# EAGLE design Board_Master_PROTO_V2_Mob_Project (EAGLE 9.5.0)
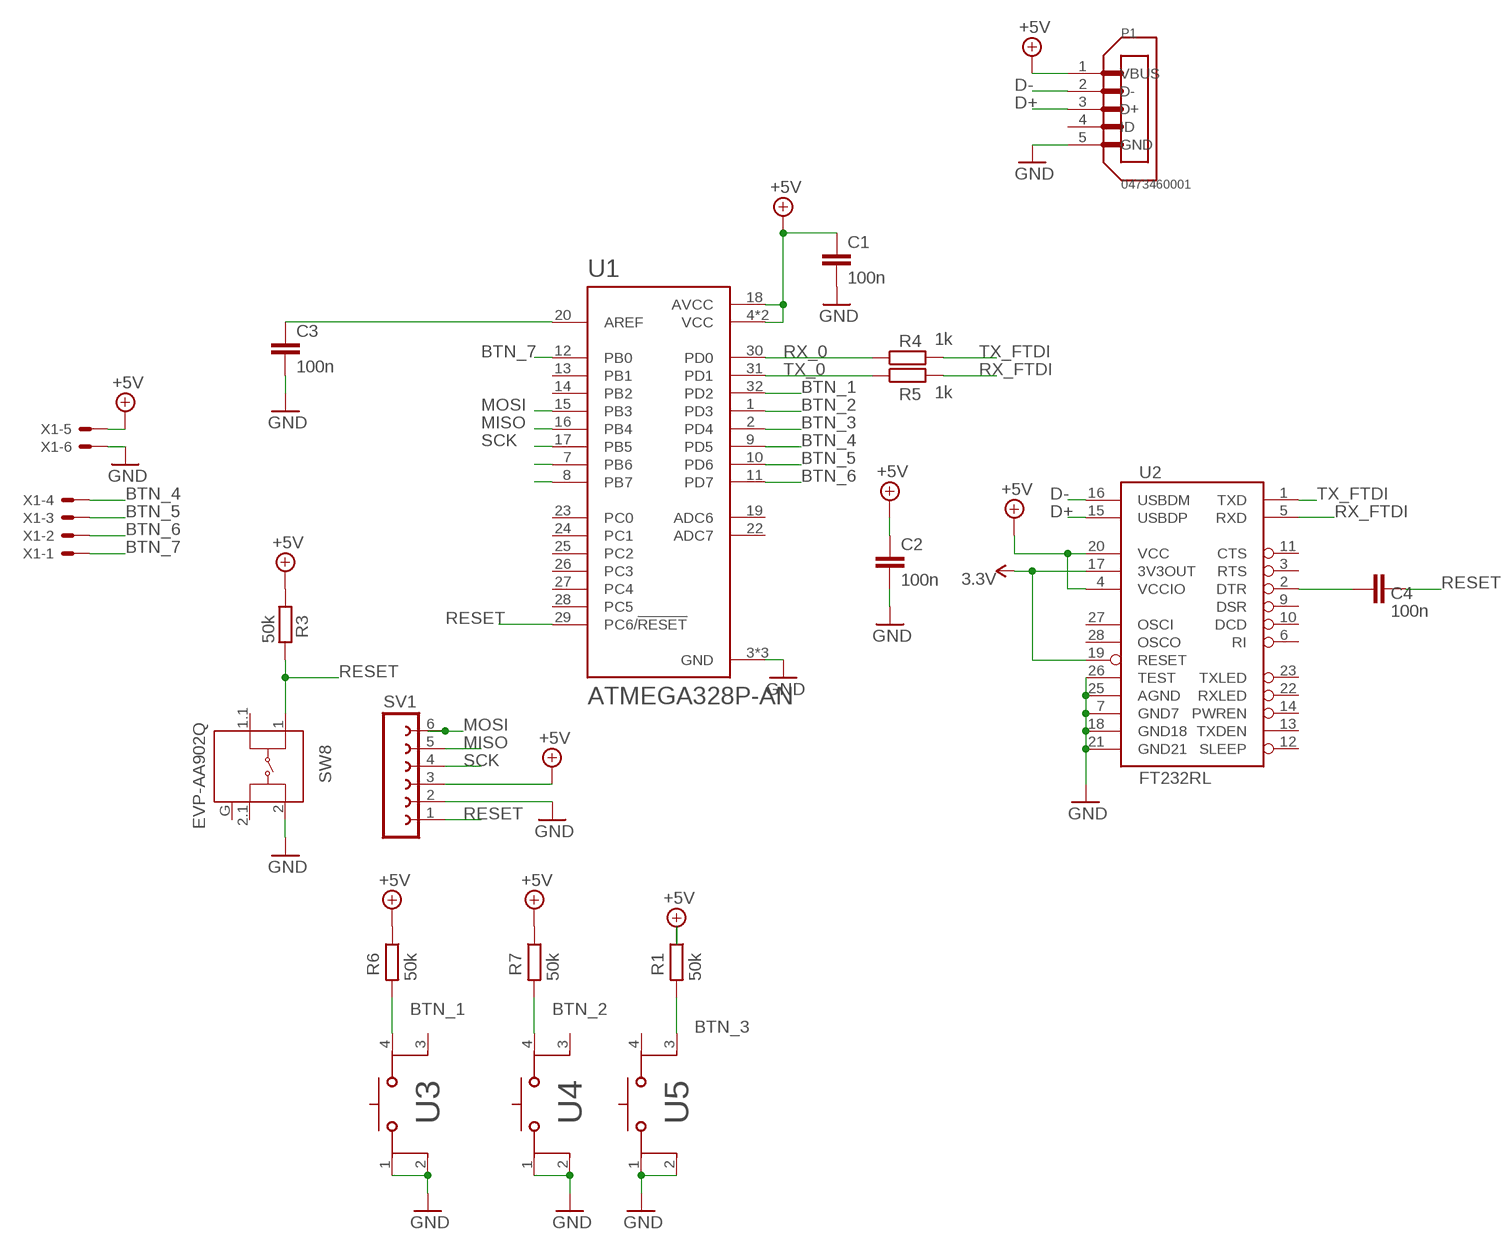
[diagram p0: schematic, sheet 1]

## Parts
C1  100n  CC0805KRX7R9BB104  [CAP_0805]
C2  100n  CC0805KRX7R9BB104  [CAP_0805]
C3  100n  CC0805KRX7R9BB104  [CAP_0805]
C4  100n  CC0805KRX7R9BB104  [CAP_0805]
P1  0473460001  [MOLEX_0473460001]
R1  50k  R-EU_R0805  [R0805]
R3  50k  R-EU_R0805  [R0805]
R4  1k  R-EU_R0805  [R0805]
R5  1k  R-EU_R0805  [R0805]
R6  50k  R-EU_R0805  [R0805]
R7  50k  R-EU_R0805  [R0805]
SV1  FE06-1  [FE06]
SW8  EVP-AA902Q  [EVP-AA902Q]
U1  ATMEGA328P-AN  [QFP80P900X900X120-32N]
U2  FT232RL  FT232RLSSOP  [SSOP28DB]
U3  4-1437565-1  [SW4_236X236H5MM]
U4  4-1437565-1  [SW4_236X236H5MM]
U5  4-1437565-1  [SW4_236X236H5MM]
X1  C-GRID-06-70543  [70543-06]

## Nets
3.3V: U2.17(3V3OUT) U2.19(RESET)
+5V: C1.1 C2.1 P1.1(VBUS) R1.1 R3.1 R6.1 R7.1 SV1.3 U1.4(VCC) U1.6(VCC) U1.18(AVCC) U2.4(VCCIO) U2.20(VCC) X1.5
BTN_1: R6.2 U1.32(PD2) U3.4
BTN_2: R7.2 U1.1(PD3) U4.4
BTN_3: R1.2 U1.2(PD4) U5.3
BTN_4: U1.9(PD5) X1.4
BTN_5: U1.10(PD6) X1.3
BTN_6: U1.11(PD7) X1.2
BTN_7: U1.12(PB0) X1.1
D+: P1.3(D+) U2.15(USBDP)
D-: P1.2(D-) U2.16(USBDM)
GND: C1.2 C2.2 C3.2 P1.5(GND) SV1.2 SW8.2 U1.3(GND) U1.5(GND) U1.21(GND) U2.7(GND7) U2.18(GND18) U2.21(GND21) U2.25(AGND) U2.26(TEST) U3.1 U3.2 U4.1 U4.2 U5.1 U5.2 X1.6
MISO: SV1.5 U1.16(PB4)
MOSI: SV1.6 U1.15(PB3)
N$2: U1.7(PB6)
N$3: U1.8(PB7)
N$5: C4.2 U2.2(DTR)
N$6: C3.1 U1.20(AREF)
RESET: C4.1 R3.2 SV1.1 SW8.1 U1.29(PC6/!RESET)
RX_0: R4.1 U1.30(PD0)
RX_FTDI: R5.2 U2.5(RXD)
SCK: SV1.4 U1.17(PB5)
TX_0: R5.1 U1.31(PD1)
TX_FTDI: R4.2 U2.1(TXD)
Unconnected: P1.4(ID) SW8.1.1 SW8.2.1 SW8.G(SHIELD) U1.13(PB1) U1.14(PB2) U1.19(ADC6) U1.22(ADC7) U1.23(PC0) U1.24(PC1) U1.25(PC2) U1.26(PC3) U1.27(PC4) U1.28(PC5) U2.3(RTS) U2.6(RI) U2.9(DSR) U2.10(DCD) U2.11(CTS) U2.12(SLEEP) U2.13(TXDEN) U2.14(PWREN) U2.22(RXLED) U2.23(TXLED) U2.27(OSCI) U2.28(OSCO) U3.3 U4.3 U5.4

## Library data of the parts
C1-C4 = Resistor_Capacitor:CC0805KRX7R9BB104: CAP CER 0.1UF 50V X7R 0805 Manufacturer's datasheet <http://www.yageo.com/documents/recent/UPY-GPHC_X7R_6.3V-to-50V_18.pdf>; CREATED_BY: PCBLayout.com; DIGIKEY_PART_NUMBER: 311-1140-2-ND; MANUFACTURER: Yageo; MPN: CC0805KRX7R9BB104; PACKAGE: SMD 0805
P1 = 0473460001:0473460001: Conn Micro USB Type B RCP 5 POS 0.65mm Solder RA SMD 5 Terminal 1 Port T/R; AVAILABILITY: Unavailable; DESCRIPTION: Conn Micro USB Type B RCP 5 POS 0.65mm Solder RA SMD 5 Terminal 1 Port T/R; MF: Weidmuller; MP: 0473460001; PACKAGE: None; PRICE: None
R1 R3-R7 = resistor:R-EU_: RESISTOR, European symbol
SV1 = con-lsta:FE06-1: FEMALE HEADER; OC_FARNELL: unknown; OC_NEWARK: unknown
SW8 = Switch:EVP-AA902Q: SWITCH TACTILE SPST-NO 0.02A 15V Manufacturer's datasheet <https://industrial.panasonic.com/ac/cdn/e/control/switch/light-touch/catalog/sw_lt_eng_3529s.pdf>; CREATED_BY: PCBLayout.com; DIGIKEY_PARTNO: P15193TR-ND; MANUFACTURER: Panasonic Electronic Components; MPN: EVP-AA902Q
U1 = ATMEGA328P-AN:ATMEGA328P-AN: ATmega Series 20 MHz 32 KB Flash 2 KB SRAM 8-Bit Microcontroller - TQFP-32; AVAILABILITY: Unavailable; DESCRIPTION: MCU 8-bit ATmega AVR RISC 32KB Flash 2.5V/3.3V/5V 32-Pin TQFP Tray; MF: Microchip; MP: ATMEGA328P-AN; PACKAGE: TQFP-32 Microchip; PRICE: None
U2 = SparkFun-IC-Comms:FT232RL: FT232RL USB UART FT232RL 4th Generation USB UART (USB <-> Serial) Controller. Datasheet <http://www.sparkfun.com/datasheets/IC/FT232R_v104.pdf> SparkFun Products Component <https://www.sparkfun.com/products/650> (COM-00650) SparkFun RedBot Mainboard <https://www.sparkfun.com/products/12097> (ROB-12097) SparkFun FTDI Basic Breakout - 5V <https://www.sparkfun.com/products/9716> (DEV-09716) SparkFun FTDI Basic Breakout - 3.3V <https://www.sparkfun.com/products/9873> (DEV-09873) Bus Pirate - v3.6a <https://www.sparkfun.com/products/12942> (TOL-12942) SparkFun USB to Serial Breakout - FT232RL <https://www.sparkfun.com/products/12731> (BOB-12731) SparkFun PicoBoard <https://www.sparkfun.com/products/11888> (WIG-11888) SparkFun RFID USB Reader <https://www.sparkfun.com/products/9963> (SEN-09963) LilyPad FTDI Basic Breakout - 5V <https://www.sparkfun.com/products/10275> (DEV-10275) SparkFun Stepoko <https://www.sparkfun.com/products/13899> (ROB-13899); PROD_ID: IC-00870
U3-U5 = Switches:4-1437565-1; BUILT_BY: EMA_UL_Team; CATEGORY: Tactile Switches; COPYRIGHT: Copyright (C) 2016 Accelerated Designs. All rights reserved; DESCRIPTION: FSM4JSMA=SMT,TACTILE,PB SWITCH; MANUFACTURER_PART_NUMBER: 4-1437565-1; PART_STATUS: active; SERIES: Alcoswitch FSMJSMA; VENDOR: TE Connectivity
X1 = con-molex:C-GRID-06: CONNECTOR wire to board 2.54 mm (0.100") pitch header; MF: MOLEX; OC_FARNELL: unknown; OC_NEWARK: unknown

## Board
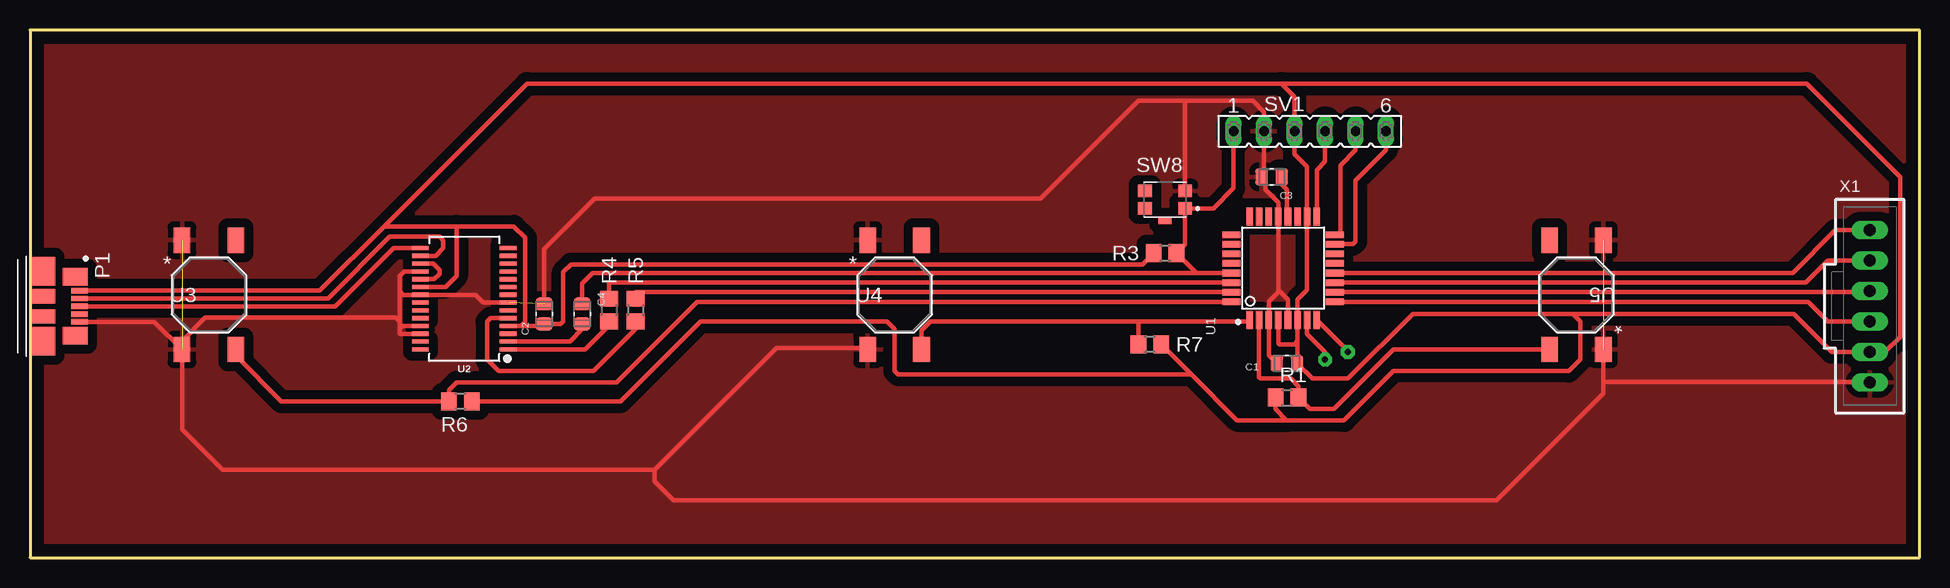
[diagram p1: board, top side]
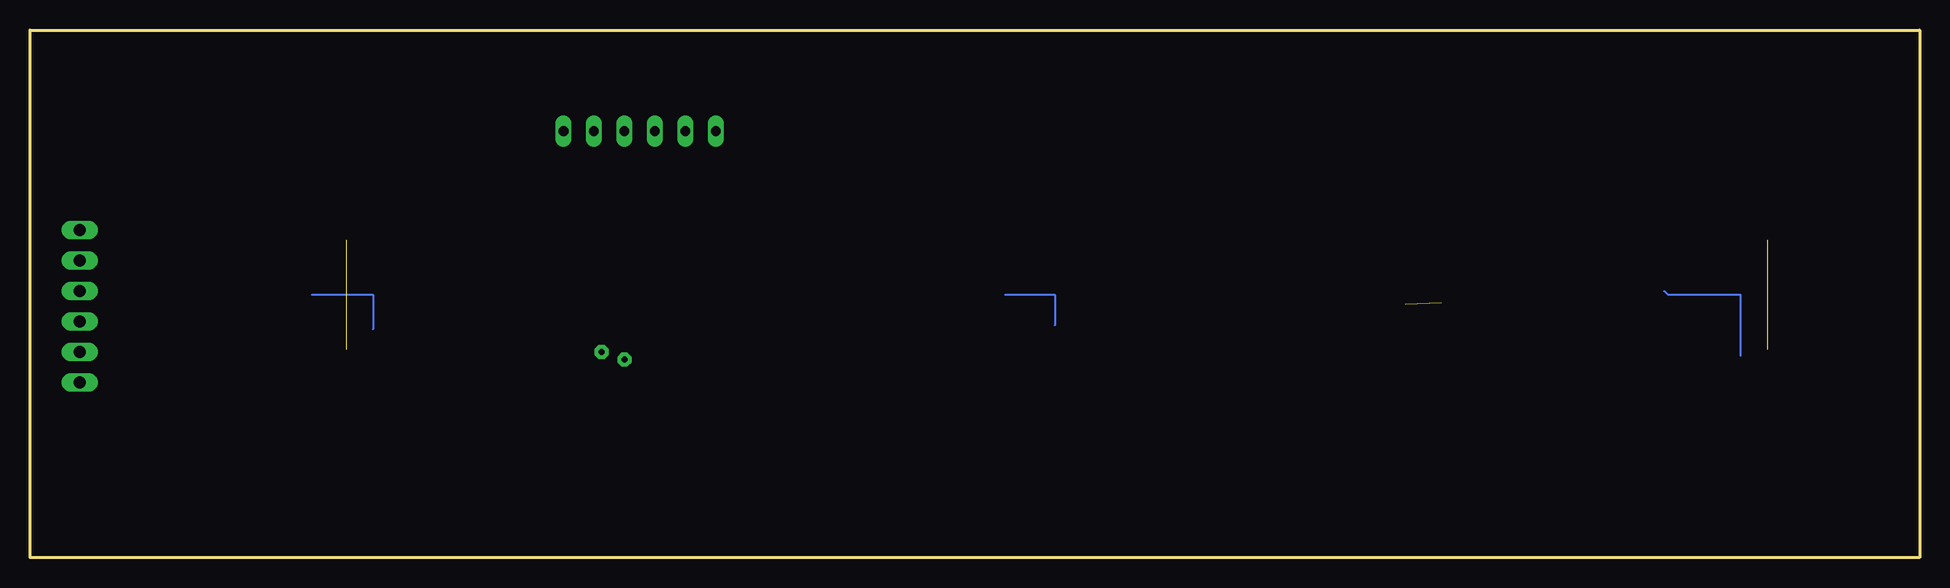
[diagram p2: board, bottom side, seen from below]

Size 157.5 x 44 mm. Coordinates in mm from the lower left corner, seen from the top.
Outline: 157.5,44 0,44 0,0 157.5,0 157.5,44
Copper layers (1*16): Top 0.035mm / dielectric 1.5mm / Bottom 0.035mm
Design rules "default *": minimum track width 10mil, minimum drill 0.35mm, track to track 6mil, track to pad 6mil, pad to pad 4mil, via to via 10mil, smd to smd 4mil, copper to edge 40mil, drill to drill 6mil, minimum pad ring 10mil, minimum via ring 8mil, stop-mask expansion 4mil, vias tented up to drill 0mil, thermal gap 20mil

### Footprints (pad centres in the part's own frame; a part is rotated, then mirrored left to right if it is on the bottom)
CAP_0805 = smd 1.05 x 1.38: 1 -0.84,0; 2 0.84,0
MOLEX_0473460001 = smd 0.45 x 1.38: 1 -1.3,0; 2 -0.65,0; 3 0,0; 4 0.65,0; 5 1.3,0 | smd 1.475 x 2.1: P1 -2.462,-0.36; P2 2.462,-0.36 | smd 2.375 x 1.9: P3 -2.913,-2.99; P6 2.913,-2.99 | smd 1.175 x 1.9: P4 -0.838,-2.99; P5 0.838,-2.99
R0805 = smd 1.3 x 1.5: 1 -0.95,0; 2 0.95,0
FE06 = drill 0.813 long: 1 -6.35,0; 2 -3.81,0; 3 -1.27,0; 4 1.27,0; 5 3.81,0; 6 6.35,0
EVP-AA902Q = smd 1.15 x 1.05: 1 -1.675,0.725; 1.1 1.675,0.725; 2 -1.675,-0.725; 2.1 1.675,-0.725 | smd 1.1 x 0.6: G 0,1.75
QFP80P900X900X120-32N = smd 1.5 x 0.55: 1 -4.3,2.8; 2 -4.3,2; 3 -4.3,1.2; 4 -4.3,0.4; 5 -4.3,-0.4; 6 -4.3,-1.2; 7 -4.3,-2; 8 -4.3,-2.8; 17 4.3,-2.8; 18 4.3,-2; 19 4.3,-1.2; 20 4.3,-0.4; 21 4.3,0.4; 22 4.3,1.2; 23 4.3,2; 24 4.3,2.8 | smd 0.55 x 1.5: 9 -2.8,-4.3; 10 -2,-4.3; 11 -1.2,-4.3; 12 -0.4,-4.3; 13 0.4,-4.3; 14 1.2,-4.3; 15 2,-4.3; 16 2.8,-4.3; 25 2.8,4.3; 26 2,4.3; 27 1.2,4.3; 28 0.4,4.3; 29 -0.4,4.3; 30 -1.2,4.3; 31 -2,4.3; 32 -2.8,4.3
SSOP28DB = smd 0.348 x 1.397: 1 -4.225,-3.656; 2 -3.575,-3.656; 3 -2.925,-3.656; 4 -2.275,-3.656; 5 -1.625,-3.656; 6 -0.975,-3.656; 7 -0.325,-3.656; 8 0.325,-3.656; 9 0.975,-3.656; 10 1.625,-3.656; 11 2.275,-3.656; 12 2.925,-3.656; 13 3.575,-3.656; 14 4.225,-3.656; 15 4.225,3.656; 16 3.575,3.656; 17 2.925,3.656; 18 2.275,3.656; 19 1.625,3.656; 20 0.975,3.656; 21 0.325,3.656; 22 -0.325,3.656; 23 -0.975,3.656; 24 -1.625,3.656; 25 -2.275,3.656; 26 -2.925,3.656; 27 -3.575,3.656; 28 -4.225,3.656
SW4_236X236H5MM = smd 1.397 x 2.108: 1 -2.248,4.559; 2 -2.248,-4.559; 3 2.248,4.559; 4 2.248,-4.559
70543-06 = drill 1.016 long: 1 -6.35,0; 2 -3.81,0; 3 -1.27,0; 4 1.27,0; 5 3.81,0; 6 6.35,0

### Placement (x,y rotation side)
C1  104.78,16.19 180 top
C2  42.86,20.32 90 top
C3  103.5,31.75 180 top
C4  46.04,20.32 270 top
P1  4.13,20.95 270 top
R1  104.78,13.34 0 top
R3  94.62,25.4 0 top
R4  48.26,20.64 270 top
R5  50.48,20.64 270 top
R6  35.88,13.02 180 top
R7  93.34,17.78 180 top
SV1  106.68,35.56 0 top
SW8  94.62,29.84 180 top
U1  104.46,24.13 90 top
U2  36.2,21.59 90 top
U3  14.92,21.91 0 top
U4  72.07,21.91 0 top
U5  128.91,21.91 180 top
X1  153.35,20.95 270 top

### Tracks (layer width: path | path; a pad name or v marks a point on that pad's centre or on a via)
3.3V
  Top 0.381: U2.17 33.59,24.52 34.13,23.97 34.13,23.65 33.69,23.21 U2.19
+5V
  Top 0.381: 35.56,27.62 35.56,23.5 34.63,22.56 U2.20 | 40.96,19.31 42.7,19.31 C2.1 44.24,19.48 44.45,19.68 44.45,23.81 45.09,24.45 92.71,24.45 R3.1 | 40.96,19.31 41.27,19.63 41.27,26.67 40.32,27.62 35.56,27.62 | 105.66,18.05 U1.6 105.66,21.52 106.46,22.32 U1.18 106.46,32.61 105.41,33.66 SV1.3 105.41,38.42 104.3,39.53 | 105.66,18.05 105.66,16.24 C1.1 106.89,14.92 109.86,14.92 115.25,20.32 128.59,20.32 | U1.4 104.06,17.86 104.14,17.78 105.38,17.78 105.66,18.05 | 128.59,20.32 147,20.32 150.18,17.14 X1.5 154.62,17.14 155.89,18.41 155.89,31.75 148.11,39.53 104.3,39.53 | P1.1 24.16,22.25 29.53,27.62 | 128.59,20.32 129.22,19.68 129.22,16.51 128.27,15.56 113.67,15.56 109.54,11.43 104.78,11.43 104.75,11.46 | R6.1 49.21,13.02 55.88,19.68 71.44,19.68 72.07,19.05 72.07,15.56 72.36,15.27 96.81,15.27 | 29.53,27.62 35.56,27.62 | 29.53,27.62 41.43,39.53 104.3,39.53 | U2.4 40.96,19.31 | R7.1 96.81,15.27 | 96.81,15.27 100.62,11.46 104.75,11.46 | R1.1 103.83,12.38 104.75,11.46
BTN_1
  Top 0.381: U1.32 55.62,21.33 48.9,14.61 35.56,14.61 34.93,13.97 R6.2 | R6.2 | U3.4 17.17,16.8 20.96,13.01 R6.2
BTN_2
  Top 0.381: 92.39,19.68 R7.2 | 92.39,19.68 101.51,19.68 U1.1 | U4.4 74.32,18.94 75.07,19.68 92.39,19.68
BTN_3
  Top 0.381: U1.2 102.46,15.02 102.56,14.92 105.09,14.92 105.72,14.29 R1.2 106.68,12.38 108.67,12.38 113.64,17.35 U5.3
BTN_4
  Top 0.381: U1.9 148.21,21.33 149.86,19.68 X1.4
BTN_5
  Top 0.381: X1.3 153.26,22.13 U1.10
BTN_6
  Top 0.381: X1.2 149.86,24.77 148.03,22.93 U1.11
BTN_7
  Top 0.381: X1.1 150.5,27.3 146.92,23.73 U1.12
D+
  Top 0.381: U2.15 30.32,25.81 25.46,20.95 P1.3
D-
  Top 0.381: U2.16 33.81,25.16 34.44,25.8 34.44,26.43 34.13,26.75 30,26.75 24.85,21.61 P1.2
GND  (3 unrouted)
  Top 0.381: 30.8,22.23 31.11,21.91 U2.21 37.14,21.91 37.79,21.27 U2.7 | 30.8,22.23 30.8,23.5 31.17,23.86 U2.18 | U2.26 30.87,18.66 30.8,18.73 30.8,19.05 | C2.2 42.86,25.72 47.08,29.93 84.22,29.93 92.39,38.1 96.2,38.1 | U1.5 104.86,21.51 104.14,22.23 | 104.14,22.23 104.06,22.31 U1.21 104.06,29.61 102.98,30.69 102.98,31.43 C3.2 102.87,31.96 SV1.2 102.87,37.15 101.92,38.1 96.2,38.1 | 104.14,22.23 103.26,21.34 U1.3 103.26,16.87 C1.2 | 52.07,7.3 52.07,6.35 53.66,4.76 122.24,4.76 131.15,13.68 131.15,14.63 | 52.07,7.3 62.23,17.46 69.71,17.46 U4.2 | U5.1 131.15,14.63 | U3.2 12.68,10.68 16.05,7.3 52.07,7.3 | SW8.2 96.29,38.01 96.2,38.1 | X1.6 153.33,14.63 131.15,14.63 | U3.2 10.37,19.66 P1.5 | U3.2 12.68,18.07 14.61,20 30.48,20 30.8,19.68 | 30.8,22.23 30.8,19.68 | 30.8,19.68 30.8,19.05 | U2.25 31.06,19.31 30.8,19.05
  pour Top (isolate 0.762): 0,44.13 0,0 157.48,0 157.48,44.13
MISO
  Top 0.381: U1.16 108.86,27.03 108.9,26.99 109.22,26.99 109.22,32.7 110.49,33.97 SV1.5
MOSI
  Top 0.381: U1.15 110.27,26.13 110.49,26.35 110.49,31.43 113.03,33.97 SV1.6
N$1
  Bottom 0.152: 133.99,21.91 128.91,21.91 128.91,19.05
N$2  (via drill 0.51 pad 1.15)
  Top 0.381: U1.7 106.46,18.64 107.95,17.14 v107.95,16.51
N$3  (via drill 0.51 pad 1.15)
  Top 0.381: U1.8 109.86,17.23 v109.86,17.14
N$4
  Bottom 0.152: 76.2,21.91 72.07,21.91 72.07,19.37
N$5
  Top 0.381: U2.2 45,18.02 46.04,19.05 C4.2
N$6
  Top 0.381: C3.1 104.34,31.11 104.78,30.68 104.78,28.51 U1.20
N$7
  Bottom 0.152: 21.27,22.23 20.95,21.91 14.92,21.91 14.92,16.83
RESET
  Top 0.381: SV1.1 100.33,30.8 98.65,29.12 SW8.1 96.29,26.12 R3.2 97.23,23.73 | C4.1 46.04,22.86 46.91,23.73 97.23,23.73 | U1.29 97.23,23.73
RX_0
  Top 0.381: R4.1 48.26,22.93 U1.30
RX_FTDI
  Top 0.381: U2.5 38.38,19.96 38.1,19.68 38.1,16.51 39.05,15.56 46.99,15.56 50.48,19.05 R5.2
SCK
  Top 0.381: SV1.4 107.95,33.02 107.26,32.33 U1.17
TX_0
  Top 0.381: R5.1 50.48,22.13 U1.31
TX_FTDI
  Top 0.381: U2.1 46.26,17.36 48.26,19.37 R4.2